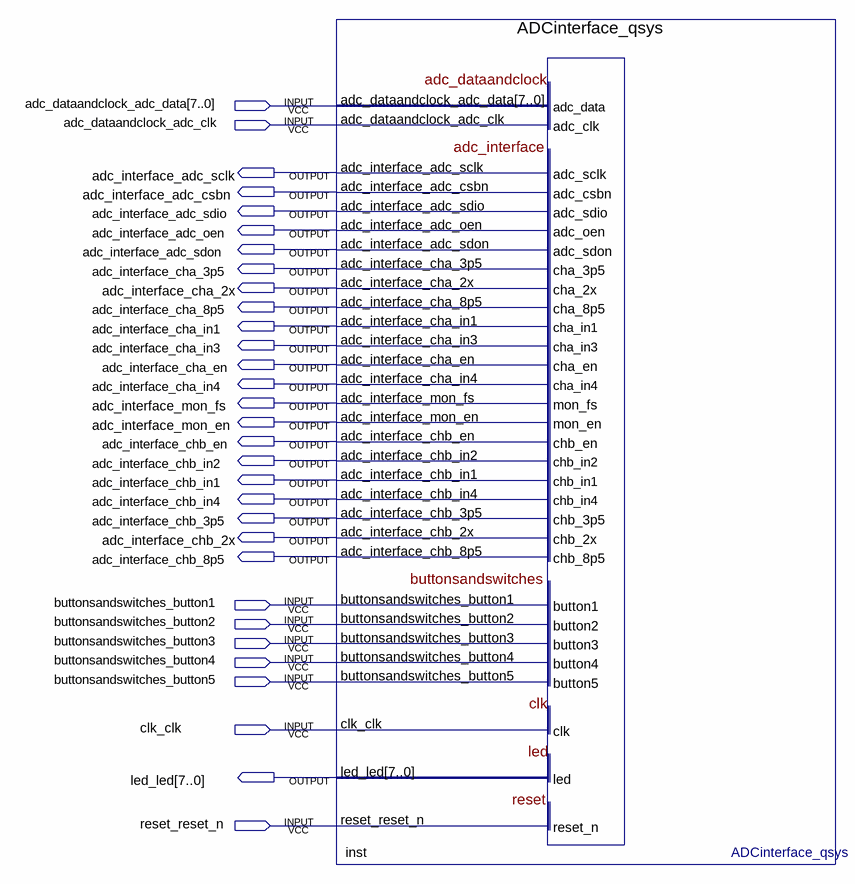
[diagram p0: schematic sheet]
// Quartus schematic ADCinterface_blockdiagram.bdf as structural Verilog: 1 symbols, 31 pins
module ADCinterface_blockdiagram (
  input  [7:0] adc_dataandclock_adc_data,
  input  adc_dataandclock_adc_clk,
  input  buttonsandswitches_button1,
  input  buttonsandswitches_button2,
  input  buttonsandswitches_button3,
  input  buttonsandswitches_button4,
  input  buttonsandswitches_button5,
  input  clk_clk,
  input  reset_reset_n,
  output adc_interface_adc_sclk,
  output adc_interface_adc_csbn,
  output adc_interface_adc_sdio,
  output adc_interface_adc_oen,
  output adc_interface_adc_sdon,
  output adc_interface_cha_3p5,
  output adc_interface_cha_2x,
  output adc_interface_cha_8p5,
  output adc_interface_cha_in1,
  output adc_interface_cha_in3,
  output adc_interface_cha_en,
  output adc_interface_cha_in4,
  output adc_interface_mon_fs,
  output adc_interface_mon_en,
  output adc_interface_chb_en,
  output adc_interface_chb_in2,
  output adc_interface_chb_in1,
  output adc_interface_chb_in4,
  output adc_interface_chb_3p5,
  output adc_interface_chb_2x,
  output adc_interface_chb_8p5,
  output [7:0] led_led
);

  ADCinterface_qsys inst (
    .adc_dataandclock_adc_data(adc_dataandclock_adc_data),
    .adc_dataandclock_adc_clk(adc_dataandclock_adc_clk),
    .buttonsandswitches_button1(buttonsandswitches_button1),
    .buttonsandswitches_button2(buttonsandswitches_button2),
    .buttonsandswitches_button3(buttonsandswitches_button3),
    .buttonsandswitches_button4(buttonsandswitches_button4),
    .buttonsandswitches_button5(buttonsandswitches_button5), .clk_clk(clk_clk),
    .reset_reset_n(reset_reset_n), .adc_interface_adc_sclk(adc_interface_adc_sclk),
    .adc_interface_adc_csbn(adc_interface_adc_csbn), .adc_interface_adc_sdio(adc_interface_adc_sdio),
    .adc_interface_adc_oen(adc_interface_adc_oen), .adc_interface_adc_sdon(adc_interface_adc_sdon),
    .adc_interface_cha_3p5(adc_interface_cha_3p5), .adc_interface_cha_2x(adc_interface_cha_2x),
    .adc_interface_cha_8p5(adc_interface_cha_8p5), .adc_interface_cha_in1(adc_interface_cha_in1),
    .adc_interface_cha_in3(adc_interface_cha_in3), .adc_interface_cha_en(adc_interface_cha_en),
    .adc_interface_cha_in4(adc_interface_cha_in4), .adc_interface_mon_fs(adc_interface_mon_fs),
    .adc_interface_mon_en(adc_interface_mon_en), .adc_interface_chb_en(adc_interface_chb_en),
    .adc_interface_chb_in2(adc_interface_chb_in2), .adc_interface_chb_in1(adc_interface_chb_in1),
    .adc_interface_chb_in4(adc_interface_chb_in4), .adc_interface_chb_3p5(adc_interface_chb_3p5),
    .adc_interface_chb_2x(adc_interface_chb_2x), .adc_interface_chb_8p5(adc_interface_chb_8p5),
    .led_led(led_led));
endmodule
